# EAGLE design smartmeterif (EAGLE 7.1.0)
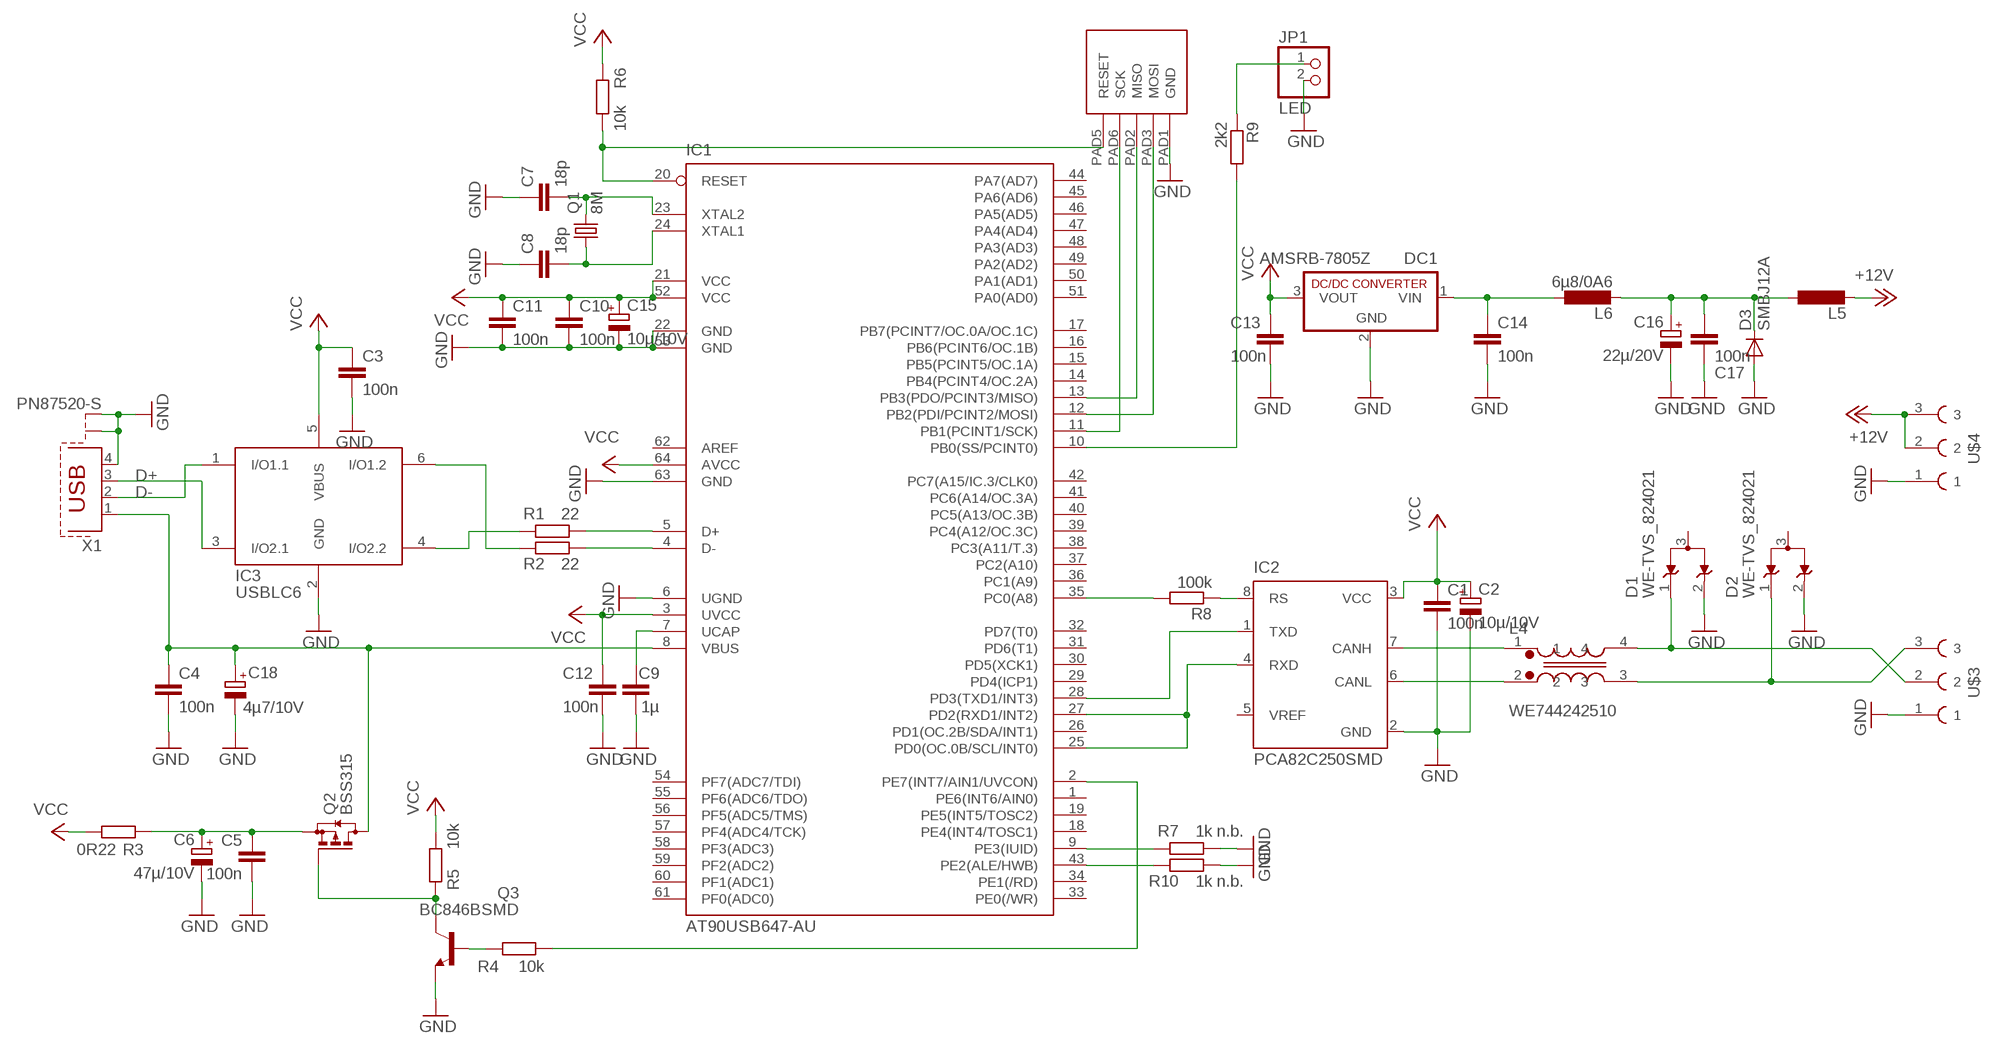
[diagram p0: schematic, sheet 1]

## Parts
C1  100n  C-EUC0603  [C0603]
C2  10µ/10V  CPOL-EUA/3216-18W  [A/3216-18W]
C3  100n  C-EUC0603  [C0603]
C4  100n  C-EUC0603  [C0603]
C5  100n  C-EUC0603  [C0603]
C6  47µ/10V  CPOL-EUSMCC  [SMC_C]
C7  18p  C-EUC0603  [C0603]
C8  18p  C-EUC0603  [C0603]
C9  1µ  C-EUC1210K  [C1210K]
C10  100n  C-EUC0603  [C0603]
C11  100n  C-EUC0603  [C0603]
C12  100n  C-EUC0603  [C0603]
C13  100n  C-EUC0603  [C0603]
C14  100n  C-EUC0603  [C0603]
C15  10µ/10V  CPOL-EUA/3216-18W  [A/3216-18W]
C16  22µ/20V  CPOL-EUSMCC  [SMC_C]
C17  100n  C-EUC0603  [C0603]
C18  4µ7/10V  CPOL-EUSMCA  [SMC_A]
D1  WE-TVS_824021  [WE-TVS_SOT23-3L]
D2  WE-TVS_824021  [WE-TVS_SOT23-3L]
D3  SMBJ12A  DIODE-SMB  [SMB]
DC1  AMSRB-7805Z  R-78C5.0-1.0  [SIP3]
IC1  AT90USB647-AU  [TQFP64]
IC2  PCA82C250SMD  [SO8]
IC3  USBLC6  [SOT23-6L]
JP1  LED  PINHD-1X2  [1X02]
L4  WE744242510  WE-SLM  [WE-SLM]
L5  L-EUL1806  [L1806]
L6  6µ8/0A6  L-EUL1812  [L1812]
Q1  8M  CRYSTALSM49  [SM49]
Q2  BSS315  BSS84  [SOT23]
Q3  BC846BSMD  [SOT23]
R1  22  R-EU_R0603  [R0603]
R2  22  R-EU_R0603  [R0603]
R3  0R22  R-EU_R0603  [R0603]
R4  10k  R-EU_R0603  [R0603]
R5  10k  R-EU_R0603  [R0603]
R6  10k  R-EU_R0603  [R0603]
R7  1k n.b.  R-EU_R0603  [R0603]
R8  100k  R-EU_R0603  [R0603]
R9  2k2  R-EU_R0603  [R0603]
R10  1k n.b.  R-EU_R0603  [R0603]
U$2  ATMEL_ISP  [ATMEL_ISP]
U$3  MKDSO_2.5/3_L  [PHOENIX_MKDSO_2.5/3_L]
U$4  MKDSO_2.5/3_L  [PHOENIX_MKDSO_2.5/3_L]
X1  PN87520-S  [PN87520-S]

## Nets
+12V: L5.2 U$4.2 U$4.3
.D+: IC3.4(I/O2.2) R1.1
.D-: IC3.6(I/O1.2) R2.1
B+: D1.1 L4.4 U$3.2
B-: D2.1 L4.3 U$3.3
D+: IC3.3(I/O2.1) X1.3
D-: IC3.1(I/O1.1) X1.2
GND: C1.2 C2.- C3.2 C4.2 C5.2 C6.- C7.1 C8.1 C9.1 C10.2 C11.2 C12.2 C13.2 C14.2 C15.- C16.- C17.2 C18.- D1.2 D2.2 D3.A DC1.2(GND) IC1.6(UGND) IC1.22(GND) IC1.53(GND) IC1.63(GND) IC2.2(GND) IC3.2(GND) JP1.2 Q3.2(E) R7.2 R10.2 U$2.PAD1(GND) U$3.1 U$4.1 X1.4 X1.S1 X1.S2
N$1: IC1.5(D+) R1.2
N$2: IC1.4(D-) R2.2
N$7: C4.1 C18.+ IC1.8(VBUS) Q2.3(D) X1.1
N$8: C5.1 C6.+ Q2.2(S) R3.1
N$9: IC1.2(PE7(INT7/AIN1/UVCON)) R4.2
N$10: IC2.7(CANH) L4.1
N$11: Q2.1(G) Q3.3(C) R5.1
N$12: Q3.1(B) R4.1
N$13: IC1.10(PB0(SS/PCINT0)) R9.2
N$14: JP1.1 R9.1
N$15: IC1.35(PC0(A8)) R8.2
N$16: IC1.28(PD3(TXD1/INT3)) IC2.1(TXD)
N$17: IC2.6(CANL) L4.2
N$18: IC1.25(PD0(OC.0B/SCL/INT0)) IC1.27(PD2(RXD1/INT2)) IC2.4(RXD)
N$19: IC1.43(PE2(ALE/HWB)) R10.1
N$20: IC1.20(RESET) R6.2 U$2.PAD5(RESET)
N$21: IC1.11(PB1(PCINT1/SCK)) U$2.PAD6(SCK)
N$22: IC1.12(PB2(PDI/PCINT2/MOSI)) U$2.PAD3(MOSI)
N$23: IC1.13(PB3(PDO/PCINT3/MISO)) U$2.PAD2(MISO)
N$24: C7.2 IC1.23(XTAL2) Q1.2
N$25: C8.2 IC1.24(XTAL1) Q1.1
N$26: C9.2 IC1.7(UCAP)
N$27: IC2.8(RS) R8.1
N$28: C16.+ C17.1 D3.C L5.1 L6.2
N$29: C14.1 DC1.1(VIN) L6.1
N$30: IC1.9(PE3(IUID)) R7.1
VCC: C1.1 C2.+ C3.1 C10.1 C11.1 C12.1 C13.1 C15.+ DC1.3(VOUT) IC1.3(UVCC) IC1.21(VCC) IC1.52(VCC) IC1.64(AVCC) IC2.3(VCC) IC3.5(VBUS) R3.2 R5.2 R6.1
Unconnected: D1.3(GND) D2.3(GND) IC1.1(PE6(INT6/AIN0)) IC1.14(PB4(PCINT4/OC.2A)) IC1.15(PB5(PCINT5/OC.1A)) IC1.16(PB6(PCINT6/OC.1B)) IC1.17(PB7(PCINT7/OC.0A/OC.1C)) IC1.18(PE4(INT4/TOSC1)) IC1.19(PE5(INT5/TOSC2)) IC1.26(PD1(OC.2B/SDA/INT1)) IC1.29(PD4(ICP1)) IC1.30(PD5(XCK1)) IC1.31(PD6(T1)) IC1.32(PD7(T0)) IC1.33(PE0(/WR)) IC1.34(PE1(/RD)) IC1.36(PC1(A9)) IC1.37(PC2(A10)) IC1.38(PC3(A11/T.3)) IC1.39(PC4(A12/OC.3C)) IC1.40(PC5(A13/OC.3B)) IC1.41(PC6(A14/OC.3A)) IC1.42(PC7(A15/IC.3/CLK0)) IC1.44(PA7(AD7)) IC1.45(PA6(AD6)) IC1.46(PA5(AD5)) IC1.47(PA4(AD4)) IC1.48(PA3(AD3)) IC1.49(PA2(AD2)) IC1.50(PA1(AD1)) IC1.51(PA0(AD0)) IC1.54(PF7(ADC7/TDI)) IC1.55(PF6(ADC6/TDO)) IC1.56(PF5(ADC5/TMS)) IC1.57(PF4(ADC4/TCK)) IC1.58(PF3(ADC3)) IC1.59(PF2(ADC2)) IC1.60(PF1(ADC1)) IC1.61(PF0(ADC0)) IC1.62(AREF) IC2.5(VREF)

## Library data of the parts
C1 C3-C5 C10-C14 C17 = resistor:C-EU: CAPACITOR, European symbol
C2 C6 C15 C16 C18 = rcl:CPOL-EU: POLARIZED CAPACITOR, European symbol
C7-C9 = rcl:C-EU: CAPACITOR, European symbol
D1 D2 = EagleLibrary_Wuerth_Elektronik_eiSos_V6_20140807:WE-TVS_824021: TVS Diode Array WE-TVS, Standard Series - Low capazity - No leakage current - Low clamping voltage - high ESD voltage protection - Uni- and bidirectional protection -- DC Distribution -- Headsets and Accessoires -- PDAs -- Digital Cameras -- MP3-Players -- Touch Panels <http://katalog.we-online.de/media/images/eisos/VarTVS_highspeed_pf2.jpg.jpg> Details see: http://katalog.we-online.de/en/pbs/WE-TVS_High_Speed? Updated by Dan Xu 2014-07-11 2014 (C) Würth Elektronik
D3 = diode:DIODE-: DIODE
DC1 = dc-dc-converter:R-78C*-1.0: INNOLINE DC/DC-Converter 1.0 AMP SIP3 Single Output Source: Data sheet <http://www.mikrocontroller.net/attachment/150645/157764-da-01-en-DC_DC_WANDLER_R_78C5_0_1_0.pdf>
IC1 = at90usb:AT90USB647-*: Atmel AT90USB647 AVR Microcontroller with USB Interface and 64kB Flash Memory
IC2 = mylib:PCA82C250: CAN CONTROLLER INTERFACE
IC3 = mylib:USBLC6
JP1 = pinhead:PINHD-1X2: PIN HEADER
L4 = EagleLibrary_Wuerth_Elektronik_eiSos_V6_20140807:WE-SLM: SMD Common Mode Line Filter WE-SLM - Small size - Low Profile - High Impedance - High current capability up to 300 mA -- USB -- CAN -- Firewire -- Data Lines -- Power supply systems -- Signal Lines <http://katalog.we-online.de/media/images/eisos/IndSLM_pf2.jpg> Details see: http://katalog.we-online.de/en/pbs/WE-SLM?? Updated by Dan Xu 2014-07-11 2014 (C) Würth Elektronik
L5 = mylib:L-EU: INDUCTOR, European symbol
L6 = rcl:L-EU: INDUCTOR, European symbol
Q1 = crystal:CRYSTAL: CRYSTAL; OC_FARNELL: unknown; OC_NEWARK: unknown
Q2 = transistor-small-signal:BSS84: P-CHANNEL MOS FET
Q3 = transistor-npn:BC846*: NPN Transistor
R1-R7 R10 = rcl:R-EU_: RESISTOR, European symbol
R8 R9 = resistor:R-EU_: RESISTOR, European symbol
U$2 = mylib:ATMEL_ISP
U$3 U$4 = mylib:MKDSO_2.5/3_L
X1 = con-berg:PN87520-S; OC_FARNELL: unknown; OC_NEWARK: unknown

## Board
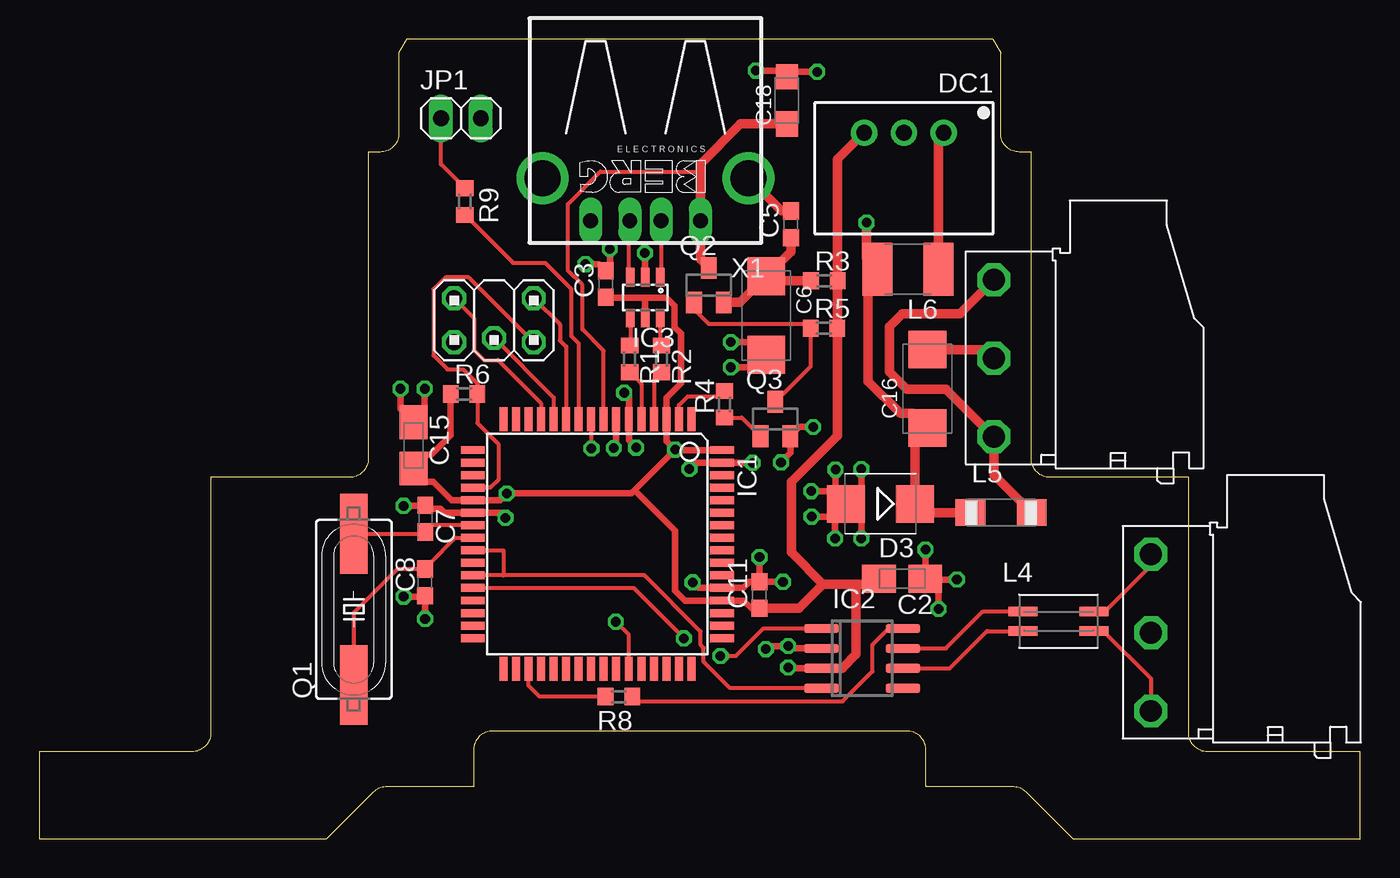
[diagram p1: board, top side]
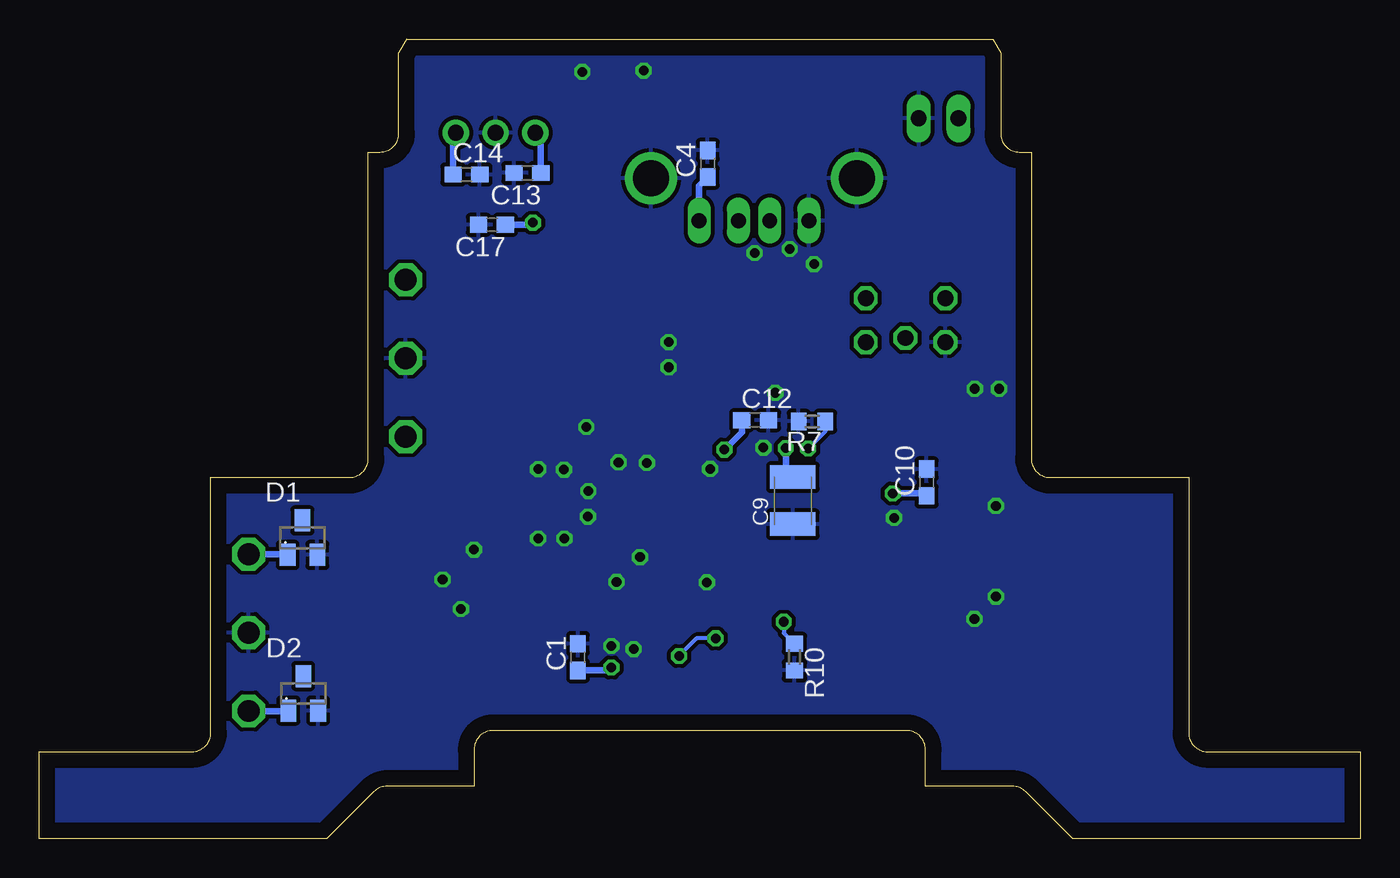
[diagram p2: board, bottom side, seen from below]

Size 84.3 x 51 mm. Coordinates in mm from the lower left corner, seen from the top.
Copper layers (1*16): Top 0.035mm / dielectric 1.5mm / Bottom 0.035mm
Design rules "Bilex DRU *": minimum track width 10mil, minimum drill 24mil, track to track 10mil, track to pad 10mil, pad to pad 10mil, via to via 10mil, smd to smd 10mil, copper to edge 40mil, drill to drill 8mil, minimum pad ring 10mil, minimum via ring 8mil, stop-mask expansion 4mil, vias tented up to drill 0mil, thermal gap 10mil

### Footprints (pad centres in the part's own frame; a part is rotated, then mirrored left to right if it is on the bottom)
C0603 = smd 1.1 x 1: 1 -0.85,0; 2 0.85,0
A/3216-18W = smd 2.15 x 1.8: + 1.475,0; - -1.475,0
SMC_C = smd 2.4 x 2.4: + -2.5,0; - 2.5,0
C1210K = smd 1.5 x 2.9: 1 -1.5,0; 2 1.5,0
SMC_A = smd 1.6 x 1.4: + -1.5,0; - 1.5,0
WE-TVS_SOT23-3L = smd 1 x 1.4: 1 -0.95,-1.1; 2 0.95,-1.1; 3 0,1.1
SMB = smd 2.4 x 2.4: A 2.2,0; C -2.2,0
SIP3 = drill 1 pad 1.676: 1 -2.54,0; 2 0,0; 3 2.54,0
TQFP64 = smd 1.524 x 0.508: 1 -7.952,6; 2 -7.952,5.2; 3 -7.952,4.4; 4 -7.952,3.6; 5 -7.952,2.8; 6 -7.952,2; 7 -7.952,1.2; 8 -7.952,0.4; 9 -7.952,-0.4; 10 -7.952,-1.2; 11 -7.952,-2; 12 -7.952,-2.8; 13 -7.952,-3.6; 14 -7.952,-4.4; 15 -7.952,-5.2; 16 -7.952,-6; 33 7.952,-6; 34 7.952,-5.2; 35 7.952,-4.4; 36 7.952,-3.6; 37 7.952,-2.8; 38 7.952,-2; 39 7.952,-1.2; 40 7.952,-0.4; 41 7.952,0.4; 42 7.952,1.2; 43 7.952,2; 44 7.952,2.8; 45 7.952,3.6; 46 7.952,4.4; 47 7.952,5.2; 48 7.952,6 | smd 0.508 x 1.524: 17 -6,-7.952; 18 -5.2,-7.952; 19 -4.4,-7.952; 20 -3.6,-7.952; 21 -2.8,-7.952; 22 -2,-7.952; 23 -1.2,-7.952; 24 -0.4,-7.952; 25 0.4,-7.952; 26 1.2,-7.952; 27 2,-7.952; 28 2.8,-7.952; 29 3.6,-7.952; 30 4.4,-7.952; 31 5.2,-7.952; 32 6,-7.952; 49 6,7.952; 50 5.2,7.952; 51 4.4,7.952; 52 3.6,7.952; 53 2.8,7.952; 54 2,7.952; 55 1.2,7.952; 56 0.4,7.952; 57 -0.4,7.952; 58 -1.2,7.952; 59 -2,7.952; 60 -2.8,7.952; 61 -3.6,7.952; 62 -4.4,7.952; 63 -5.2,7.952; 64 -6,7.952
SO8 = smd 0.6 x 2.2: 1 -1.905,-2.6; 2 -0.635,-2.6; 3 0.635,-2.6; 4 1.905,-2.6; 5 1.905,2.6; 6 0.635,2.6; 7 -0.635,2.6; 8 -1.905,2.6
SOT23-6L = smd 0.55 x 1.2: 1 -0.95,-1.3; 2 0,-1.3; 3 0.95,-1.3; 4 0.95,1.3; 5 0,1.3; 6 -0.95,1.3
1X02 = drill 1.016 long: 1 -1.27,0; 2 1.27,0
WE-SLM = smd 1.85 x 0.6: 1 -2.28,0.63; 2 -2.28,-0.62; 3 2.27,-0.62; 4 2.27,0.63
L1806 = smd 1.9 x 1.7: 1 -0.68,0; 2 3.22,0
L1812 = smd 1.9 x 3.4: 1 -1.95,0; 2 1.95,0
SM49 = smd 5.08 x 1.778: 1 -4.826,0; 2 4.826,0
SOT23 = smd 1 x 1.4: 1 -0.95,-1.1; 2 0.95,-1.1; 3 0,1.1
R0603 = smd 1 x 1.1: 1 -0.85,0; 2 0.85,0
ATMEL_ISP = drill 1.016 octagon: PAD1 1.397,-2.54; PAD2 -1.41,-2.54; PAD3 1.13,0; PAD5 1.41,2.54; PAD6 -1.41,2.54
PHOENIX_MKDSO_2.5/3_L = drill 1.4 octagon: 1 -7.1,-0.62; 2 -7.1,4.38; 3 -7.1,-5.62
PN87520-S = drill 0.95 long: 1 -3.5,2.71; 2 -1,2.71; 3 1,2.71; 4 3.5,2.71 | drill 2.3 pad 2.9: S1 -6.57,0; S2 6.57,0

### Placement (x,y rotation side)
C1  49.92,11.58 90 bottom
C2  55.05,16.59 180 top
C3  36.16,35.38 90 top
C4  41.64,43.05 90 bottom
C5  47.97,39.19 90 top
C6  46.39,33.38 270 top
C7  24.65,20.42 270 top
C8  24.62,16.36 90 top
C9  36.21,21.56 90 bottom
C10  27.67,22.73 90 bottom
C11  45.96,15.54 90 top
C12  38.62,26.7 0 bottom
C13  53.15,42.47 180 bottom
C14  57.03,42.37 0 bottom
C15  23.89,25.1 270 top
C16  56.68,28.7 90 top
C17  55.41,39.17 180 bottom
C18  47.71,47.09 90 top
D1  67.5,19.2 0 bottom
D2  67.45,9.27 0 bottom
D3  53.68,21.36 180 top
DC1  55.18,45.03 180 top
IC1  35.62,18.8 270 top
IC2  52.51,11.51 270 top
IC3  38.67,34.52 180 top
JP1  26.91,45.95 0 top
L4  65.04,13.87 0 top
L5  60.11,20.8 0 top
L6  55.43,36.32 180 top
Q1  20.08,14.63 90 top
Q2  42.73,35.31 0 top
Q3  46.98,26.77 0 top
R1  37.68,30.61 270 top
R2  39.71,30.61 270 top
R3  50.1,35.59 0 top
R4  43.72,27.71 90 top
R5  50.07,32.56 0 top
R6  27.11,28.37 0 top
R7  34.99,26.62 180 bottom
R8  36.99,9.07 180 top
R9  27.16,40.64 270 top
R10  36.1,11.58 270 bottom
U$1  [GEHÄUSE_PHOENIX_BC_17.8]  42.15,0 0 top
U$2  29.02,33.07 270 top
U$3  78.04,13.77 0 top
U$4  68.01,31.27 0 top
X1  38.69,42.13 180 top

### Tracks (layer width: path | path; a pad name or v marks a point on that pad's centre or on a via)
+12V
  Top 0.61: U$4.2 58.76,33.5 55.08,33.5 54.24,32.66 54.24,29.79 55.36,28.68 57.87,28.68 U$4.3 60.91,23.22 L5.2
.D+
  Top 0.254: IC3.4 37.72,31.46 R1.1
.D-
  Top 0.254: IC3.6 39.62,31.46 R2.1
B+
  Top 0.254: L4.4 68.03,14.5 70.94,17.41 U$3.2
  Bottom 0.406: U$3.2 68.45,18.15 D1.1
B-
  Top 0.254: L4.3 67.92,13.25 70.94,10.22 U$3.3
  Bottom 0.406: U$3.3 68.4,8.15 D2.1
D+
  Top 0.254: X1.3 37.6,39.42 37.6,35.82 IC3.3
D-
  Top 0.254: X1.2 39.69,35.82 IC3.1
GND  (via drill 0.61)
  Top 0.406: v23.25,15.44 24.56,15.44 C8.1 v24.62,14.02 | v49.64,48.92 48.04,48.92 C18.- 47.31,49 v45.73,49 | v23.25,21.23 24.61,21.23 C7.1 24.86,21.06 25.61,21.06 25.87,20.8 IC1.22 29.43,20.8 v29.75,20.47 | v23.05,28.7 23.05,27.41 C15.- 24.6,27.28 v24.6,28.7 | v41.69,16.36 42.05,16 IC1.53 44.94,16 45.34,16.39 C11.2 | C11.2 v45.96,17.96 | C11.2 45.97,16.38 v47.46,16.38 | IC2.2 47.94,12.14 v47.79,12.29 | v46.37,12.09 46.57,12.29 47.76,12.29 | v52.46,19.15 v52.46,23.57 | 50.79,21.36 v50.79,19.15 | 50.81,21.36 v50.81,23.55 | 51.48,22.17 v49.26,22.17 | D3.A 51.48,20.55 v49.29,20.55 | v56.55,18.44 56.55,16.59 | C2.- 56.53,16.54 v58.56,16.54 | 57.39,16.54 v57.39,14.66 | Q3.2 48.52,26.26 v49.39,26.26 | v47.33,24 47.94,24.61 47.94,25.63 | 45.53,24 45.52,24 IC1.63 41.89,24 v41.49,23.6 | v44.13,31.67 45.59,31.67 | C6.- 45.59,30.07 v44.13,30.07 | IC3.2 38.64,35.84 v38.64,37.36 | v37.32,28.45 37.62,28.15 IC1.6 37.62,25.41 v38.09,24.94 | v36.41,37.62 36.41,36.49 C3.2 35.74,36.65 v34.86,36.65
  Top 0.61: C16.- 60.35,31.2 U$4.1 | C5.2 47.35,40.04 X1.S1
  other vias: 45.53,23.98
  pour Bottom: 8.11,51.33 84.01,51.49 84.26,0 0.04,0.1 0.42,51.33
N$1
  Top 0.254: R1.2 38.42,29.01 IC1.5
N$2
  Top 0.254: R2.2 39.22,29.27 IC1.4
N$7
  Top 0.254: IC1.8 36.02,31.12 34.66,32.49 34.66,35.33 33.74,36.25 33.74,40.49 35.8,42.55 42.19,42.55
  Top 0.61: C18.+ 44.77,45.59 42.19,43.02 42.19,42.55 X1.1 42.19,36.95 Q2.3
  Bottom 0.406: X1.1 42.19,41.66 C4.1
N$8
  Top 0.61: Q2.2 44.72,34.21 C6.+ | C5.1 47.97,37.45 C6.+ | R3.1 46.68,35.59 C6.+
N$9
  Top 0.254: IC1.2 40.82,27.65 41.39,28.22 43.38,28.22 R4.2
N$10
  Top 0.254: IC2.7 57.87,12.14 60.23,14.5 L4.1
N$11
  Top 0.254: Q2.1 41.78,33.77 42.71,32.84 48.95,32.84 R5.1 49.22,30.12 Q3.3
N$12
  Top 0.254: R4.1 44.84,26.86 Q3.1
N$13
  Top 0.254: R9.2 30.23,36.73 32.29,36.73 33.95,35.08 33.95,32.08 34.42,31.6 IC1.10
N$14
  Top 0.254: R9.1 25.64,43.01 JP1.1
N$15
  Top 0.254: R8.2 31.91,9.07 31.22,9.76 IC1.35
N$16  (via drill 0.61)
  Top 0.254: IC1.28 37.91,16 v41.13,12.78 | v43.47,11.66 44.46,11.66 46.21,13.41 IC2.1
  Bottom 0.254: v41.13,12.78 42.35,12.78 v43.47,11.66
N$17
  Top 0.254: IC2.6 58.1,10.87 60.48,13.25 L4.2
N$18
  Top 0.254: IC2.4 44.08,9.6 42.4,11.28 42.4,12.17 42.2,12.37 42.2,13.21 38.61,16.8 29.63,16.8 | 29.63,16.8 IC1.27 | IC1.25 29.63,18.4 29.63,16.8
N$19  (via drill 0.61)
  Top 0.254: IC1.43 37.62,13.01 v36.79,13.84
  Bottom 0.254: v36.79,13.84 36.79,13.12 R10.1
N$20
  Top 0.254: 27.69,22.38 IC1.20 28.78,22.4 29.3,22.91 29.3,25.17 27.96,26.51 R6.2 27.96,29.02 27.04,29.95 26.05,29.95 25.16,30.84 25.16,35.05 25.92,35.81 27.4,35.81 U$2.PAD5
N$21
  Top 0.254: U$2.PAD6 33.23,32.8 33.23,31.77 33.62,31.39 IC1.11
N$22
  Top 0.254: U$2.PAD3 32.82,28.14 IC1.12
N$23
  Top 0.254: U$2.PAD2 27.75,33.21 27.75,31.17 28.38,30.53 29.27,30.53 32.02,27.78 IC1.13
N$24
  Top 0.254: Q1.2 24.53,19.46 C7.2 25.07,20 IC1.23
N$25
  Top 0.254: Q1.1 20.08,14.43 22.86,17.21 C8.2 24.62,17.58 24.93,17.58 26.55,19.2 IC1.24
N$26  (via drill 0.61)
  Top 0.406: IC1.7 36.82,25.08 v36.66,24.92
  Bottom 0.406: C9.2 36.66,23.52 v36.66,24.92
N$27
  Top 0.254: IC2.8 54.21,13.41 53.17,12.37 53.17,10.67 51.27,8.76 48.4,8.76 48.04,8.76 38.15,8.76 R8.1
N$28  (via drill 0.61)
  Top 0.61: L5.1 56.44,20.8 D3.C 55.88,26.2 C16.+ 55.75,27.13 54.95,27.13 52.89,29.18 52.89,35.73 L6.2 52.79,37.01 v52.79,39.29
  Bottom 0.406: C17.1 52.92,39.17 v52.79,39.29
N$29
  Top 0.61: L6.1 57.38,44.7 DC1.1
  Bottom 0.406: C14.1 57.88,44.87 DC1.1
N$30  (via drill 0.61)
  Top 0.254: IC1.9 35.22,24.91 v35.24,24.89
  Bottom 0.254: R7.1 34.14,26 v35.24,24.89
VCC  (via drill 0.61)
  Top 0.406: R6.1 26.26,25.74 25,24.49 24.62,24.49 23.89,23.75 C15.+ 23.89,23.32 24.42,22.78 25.13,22.78 26.32,21.6 IC1.21 29.4,21.6 v29.83,22.02 37.78,22.02 38,22.24 | 38,22.24 v40.57,24.82 | v40.57,24.82 40.02,25.37 IC1.3 40.02,28.12 40.96,29.06 40.96,32.23 40.55,32.64 40.55,34.01 40.04,34.52 38.67,34.52 | IC1.64 40.59,24.8 v40.57,24.82 | 38,22.24 40.57,19.66 40.57,15.82 41.2,15.2 IC1.52 44.94,15.2 45.44,14.7 C11.1 | 38.67,34.52 36.17,34.52 C3.1 | IC3.5 38.67,34.52 | IC2.3 47.84,10.87 v47.79,10.92
  Top 0.61: 50.02,16.23 48.49,14.7 C11.1 | 50.02,16.23 51.95,16.23 | 51.95,16.23 53.22,16.23 C2.+ | 50.02,16.23 47.99,18.26 47.99,22.78 50.92,25.72 R5.2 50.95,32.59 R3.2 50.95,43.34 DC1.3 | IC2.3 51.24,10.87 52.13,11.76 52.13,16.05 51.95,16.23
  Bottom 0.406: C10.1 27.81,21.75 28.08,22.02 v29.83,22.02 | C12.1 39.47,25.92 v40.57,24.82 | C1.1 47.98,10.73 v47.79,10.92 | 52.31,42.48 52.31,44.7 DC1.3
  Bottom 0.61: 52.31,42.48 C13.1